# Altium schematic sheet ESP32_Core.SchDoc
size A; Author: Erick Miranda Quinde; DrawnBy: Erick Miranda Quinde; DocumentNumber: 0000-0000-0002; Revision: V2.0; SheetNumber: 2; SheetTotal: 5
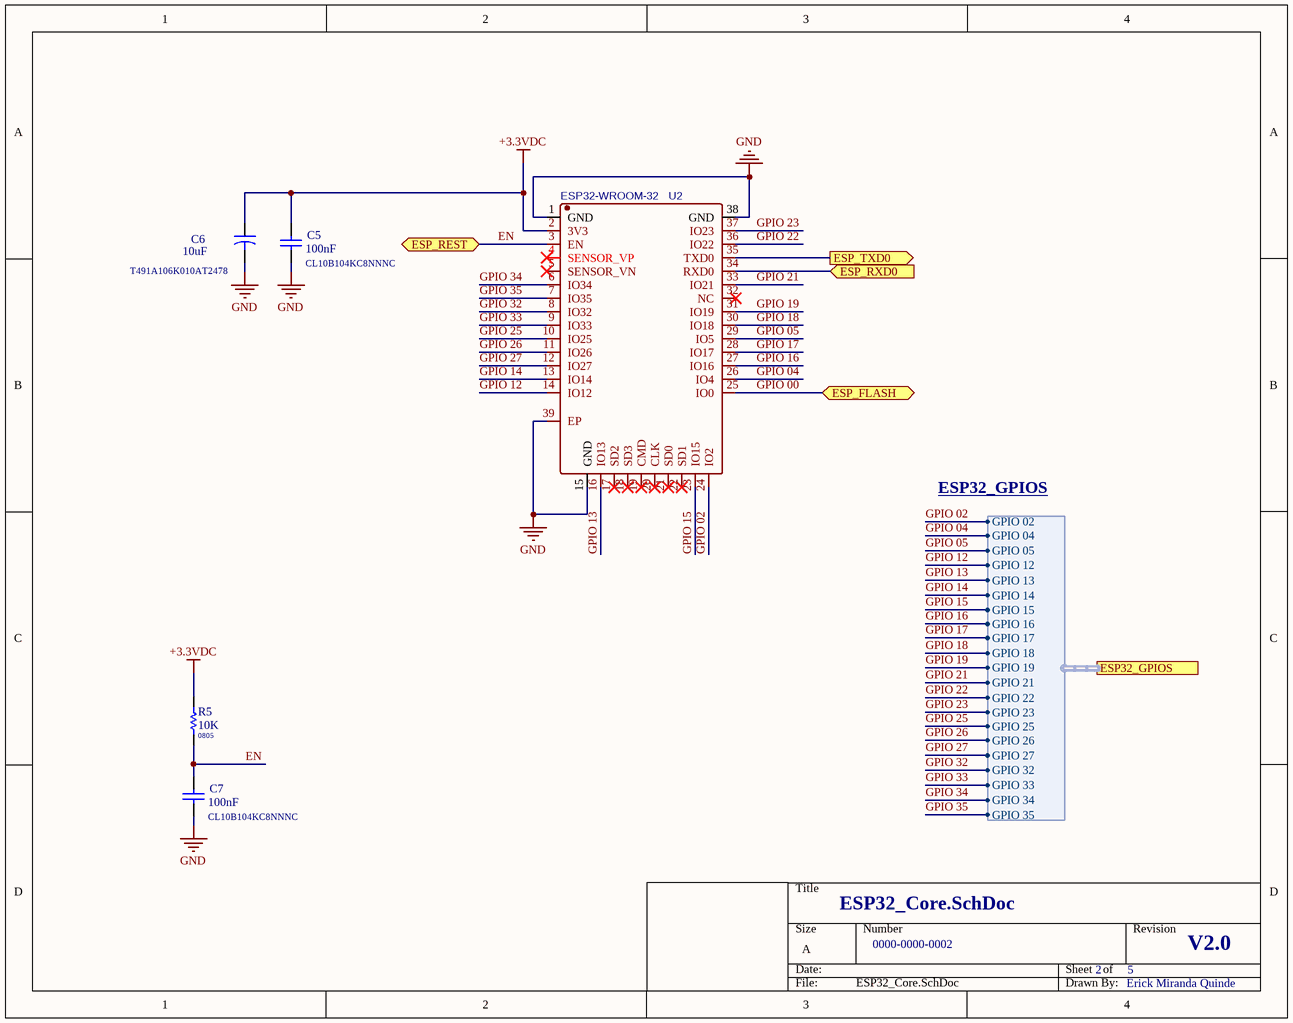
[diagram p0: ESP32_Core.SchDoc]

## Parts
C5  CL10B104KC8NNNC  value 100nF  [C0603C104K5RACTU]
C6  T491A106K010AT2478  value 10uF  [3216 Case-A]
C7  CL10B104KC8NNNC  value 100nF  [C0603C104K5RACTU]
R5  value 10K  Package: 0805  [RES-0805]  (hidden comment: 0805W8F4700T5E)
U2  ESP32-WROOM-32  [ESP-32]

## Ports
ESP32_GPIOS (harness ESP32_GPIOS), ESP_FLASH (bidir), ESP_REST (bidir), ESP_RXD0 (in), ESP_TXD0 (out)

## Harnesses
ESP32_GPIOS: GPIO 02, GPIO 04, GPIO 05, GPIO 12, GPIO 13, GPIO 14, GPIO 15, GPIO 16, GPIO 17, GPIO 18, GPIO 19, GPIO 21, GPIO 22, GPIO 23, GPIO 25, GPIO 26, GPIO 27, GPIO 32, GPIO 33, GPIO 34, GPIO 35

## Nets
+3.3VDC: C5.2 C6.1 R5.1 U2.2(3V3)
GND: C5.1 C6.2 C7.1 U2.1(GND) U2.15(GND) U2.38(GND) U2.39(EP)
EN: C7.2 R5.2 U2.3(EN) ; port ESP_REST
ESP_RXD0: U2.34(RXD0) ; port ESP_RXD0
ESP_TXD0: U2.35(TXD0) ; port ESP_TXD0
GPIO 00: U2.25(IO0) ; port ESP_FLASH
GPIO 02: U2.24(IO2) ; port ESP32_GPIOS.GPIO 02
GPIO 04: U2.26(IO4) ; port ESP32_GPIOS.GPIO 04
GPIO 05: U2.29(IO5) ; port ESP32_GPIOS.GPIO 05
GPIO 12: U2.14(IO12) ; port ESP32_GPIOS.GPIO 12
GPIO 13: U2.16(IO13) ; port ESP32_GPIOS.GPIO 13
GPIO 14: U2.13(IO14) ; port ESP32_GPIOS.GPIO 14
GPIO 15: U2.23(IO15) ; port ESP32_GPIOS.GPIO 15
GPIO 16: U2.27(IO16) ; port ESP32_GPIOS.GPIO 16
GPIO 17: U2.28(IO17) ; port ESP32_GPIOS.GPIO 17
GPIO 18: U2.30(IO18) ; port ESP32_GPIOS.GPIO 18
GPIO 19: U2.31(IO19) ; port ESP32_GPIOS.GPIO 19
GPIO 21: U2.33(IO21) ; port ESP32_GPIOS.GPIO 21
GPIO 22: U2.36(IO22) ; port ESP32_GPIOS.GPIO 22
GPIO 23: U2.37(IO23) ; port ESP32_GPIOS.GPIO 23
GPIO 25: U2.10(IO25) ; port ESP32_GPIOS.GPIO 25
GPIO 26: U2.11(IO26) ; port ESP32_GPIOS.GPIO 26
GPIO 27: U2.12(IO27) ; port ESP32_GPIOS.GPIO 27
GPIO 32: U2.8(IO32) ; port ESP32_GPIOS.GPIO 32
GPIO 33: U2.9(IO33) ; port ESP32_GPIOS.GPIO 33
GPIO 34: U2.6(IO34) ; port ESP32_GPIOS.GPIO 34
GPIO 35: U2.7(IO35) ; port ESP32_GPIOS.GPIO 35

Not connected (* = marked no-connect by the designer): U2 4(SENSOR_VP)* 5(SENSOR_VN)* 17(SD2)* 18(SD3)* 19(CMD)* 20(CLK)* 21(SD0)* 22(SD1)* 32(NC)*

## Library data of the parts
C5 C7 = Cap 100nF (0603): PART_NUM: CL10B104KC8NNNC; Price: $0.02; Link Store: https://lcsc.com/product-detail/Multilayer-Ceramic-Capacitors-MLCC-SMD-SMT_SAMSUNG_CL10B104KC8NNNC_100nF-104-10-100V_C15725.html; LCSC Part: C15725
C6 = T491A106M006AT: CAP TANT 10UF 6.3V 20% 1206; Price: $0.11; Link Store: https://lcsc.com/product-detail/Tantalum-Capacitors_KEMET_T491A106K010AT_10uF-106-10-10V_C110052.html; LCSC Part: C110052
R5 = Resistor: Published: 8-Jun-2000; LatestRevisionDate: 17-Jul-2002; LatestRevisionNote: Re-released for DXP Platform.; PackageReference: AXIAL-0.3; Publisher: Altium Limited; PackageDescription: Axial Device, Thru-Hole; 2 Leads; 0.3 in Pin Spacing; Price: $0.0025; Link Store: https://lcsc.com/product-detail/Chip-Resistor-Surface-Mount_UNI-ROYAL-Uniroyal-Elec-0805W8F4700T5E_C17710.html; LCSC Part: C17710
U2 = ESP-WROOM-32: Module WIFI Modules RoHS; LatestRevisionDate: 17-Jul-2002; LCSC Part: C95209; Link Store: https://lcsc.com/product-detail/WIFI-Modules_Espressif-Systems-ESP32-WROOM-32_C95209.html; Package: Module; Price: $2.9267; Value: WIFI